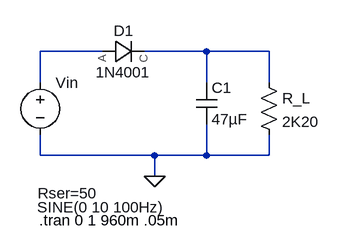
[diagram p0: schematic halfwave_rectifier.asc]
halfwave_rectifier.asc, the LTspice schematic file:
Version 4
SHEET 1 880 680
WIRE 128 96 32 96
WIRE 288 96 192 96
WIRE 384 96 288 96
WIRE 32 144 32 96
WIRE 288 144 288 96
WIRE 384 144 384 96
WIRE 32 256 32 224
WIRE 208 256 32 256
WIRE 288 256 288 208
WIRE 288 256 208 256
WIRE 384 256 384 224
WIRE 384 256 288 256
WIRE 208 288 208 256
FLAG 208 288 0
SYMBOL voltage 32 128 R0
WINDOW 3 -5 208 Left 2
WINDOW 123 0 0 Left 0
WINDOW 39 -4 186 Left 2
SYMATTR InstName Vin
SYMATTR Value SINE(0 10 100Hz)
SYMATTR SpiceLine Rser=50
SYMBOL res 368 128 R0
SYMATTR InstName R_L
SYMATTR Value 2K20
SYMBOL advee_components\\1N4001 128 112 R270
WINDOW 3 0 32 VBottom 2
WINDOW 0 32 32 VTop 2
SYMATTR InstName D1
SYMBOL cap 272 144 R0
SYMATTR InstName C1
SYMATTR Value 47µF
TEXT 30 356 Left 2 !.tran 0 1 960m .05m

The netlist it stands for:
* halfwave_rectifier.asc
Vin N001 0 SINE(0 10 100Hz) Rser=50
R_L N002 0 2K20
XD1 N001 N002 1N4001  ; pins A C
C1 N002 0 47µF
.tran 0 1 960m .05m
.lib AdvEE_Components.lib
.backanno
.end